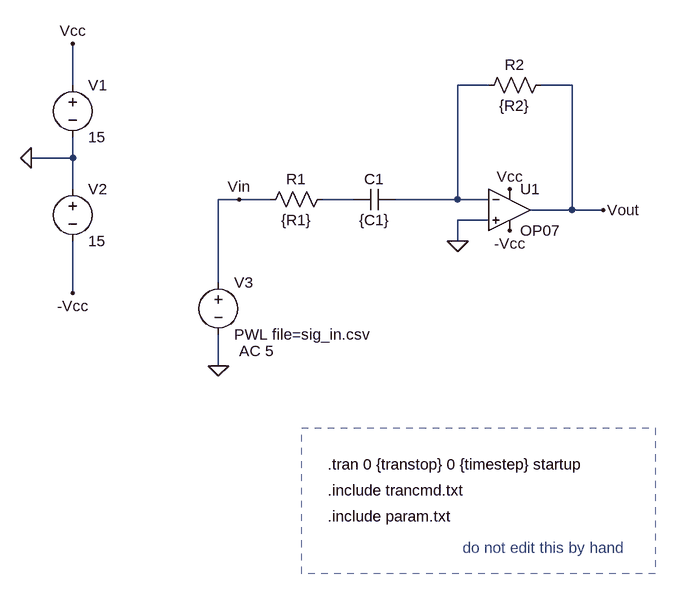
[diagram p0: schematic A2_Alta_1.asc]
A2_Alta_1.asc, the LTspice schematic file:
Version 4
SHEET 1 880 680
WIRE -336 -144 -336 -208
WIRE 304 -144 256 -144
WIRE 432 -144 384 -144
WIRE -336 -32 -336 -64
WIRE -336 -32 -400 -32
WIRE -336 16 -336 -32
WIRE -80 32 -112 32
WIRE -32 32 -80 32
WIRE 96 32 48 32
WIRE 256 32 256 -144
WIRE 256 32 160 32
WIRE 304 32 256 32
WIRE 432 48 432 -144
WIRE 432 48 368 48
WIRE 480 48 432 48
WIRE 304 64 256 64
WIRE 256 96 256 64
WIRE -112 160 -112 32
WIRE -336 176 -336 96
WIRE -112 288 -112 240
FLAG 480 48 Vout
FLAG 256 96 0
FLAG -80 32 Vin
FLAG -400 -32 0
FLAG -336 -208 Vcc
FLAG -336 176 -Vcc
FLAG 336 16 Vcc
FLAG 336 80 -Vcc
FLAG -112 288 0
SYMBOL res 64 16 R90
WINDOW 0 0 56 VBottom 2
WINDOW 3 32 56 VTop 2
SYMATTR InstName R1
SYMATTR Value {R1}
SYMBOL cap 96 48 R270
WINDOW 0 32 32 VTop 2
WINDOW 3 0 32 VBottom 2
SYMATTR InstName C1
SYMATTR Value {C1}
SYMBOL OpAmps\\OP07 336 -16 R0
SYMATTR InstName U1
SYMBOL voltage -336 -160 R0
WINDOW 123 0 0 Left 0
WINDOW 39 0 0 Left 0
SYMATTR InstName V1
SYMATTR Value 15
SYMBOL voltage -336 0 R0
WINDOW 123 0 0 Left 0
WINDOW 39 0 0 Left 0
SYMATTR InstName V2
SYMATTR Value 15
SYMBOL voltage -112 144 R0
WINDOW 123 32 121 Left 2
WINDOW 39 0 0 Left 0
SYMATTR Value2 AC 5
SYMATTR InstName V3
SYMATTR Value PWL file=sig_in.csv
SYMBOL res 400 -160 R90
WINDOW 0 0 56 VBottom 2
WINDOW 3 32 56 VTop 2
SYMATTR InstName R2
SYMATTR Value {R2}
TEXT 56 440 Left 2 !.tran 0 {transtop} 0 {timestep} startup
TEXT 56 520 Left 2 !.include param.txt
TEXT 56 480 Left 2 !.include trancmd.txt
TEXT 264 568 Left 2 ;do not edit this by hand
RECTANGLE Normal 560 608 16 384 2

The netlist it stands for:
* A2_Alta_1.asc
R1 N002 Vin {R1}
C1 N002 N001 {C1}
XU1 0 N001 Vcc -Vcc Vout LT1001  ; OP07, pins In+ In- V+ V- OUT
V1 Vcc 0 15
V2 0 -Vcc 15
V3 Vin 0 PWL file=sig_in.csv AC 5
R2 Vout N001 {R2}
.tran 0 {transtop} 0 {timestep} startup
.include param.txt
.include trancmd.txt
* do not edit this by hand
.lib LTC.lib
.backanno
.end

* Results of the author's LTspice run, read from the files saved beside the schematic
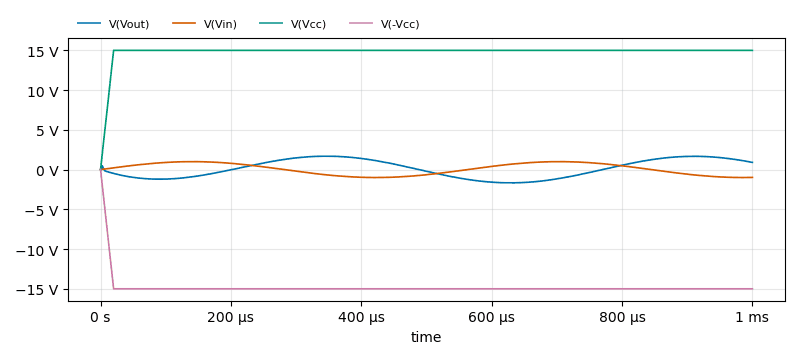
[diagram p1: Transient Analysis of A2_Alta_1.asc, plotted from the saved traces]
* Transient Analysis, 1 run:
*   V(Vout): min -1.67 V, max 1.686 V, average 126.4 mV, rms 1.152 V, last 904.7 mV
*   V(Vin): min -1 V, max 1 V, average 75.1 mV, rms 712 mV, last -986.8 mV
*   V(Vcc): min 0 V, max 15 V, average 14.85 V, rms 14.9 V, last 15 V
*   V(-Vcc): min -15 V, max 0 V, average -14.85 V, rms 14.9 V, last -15 V